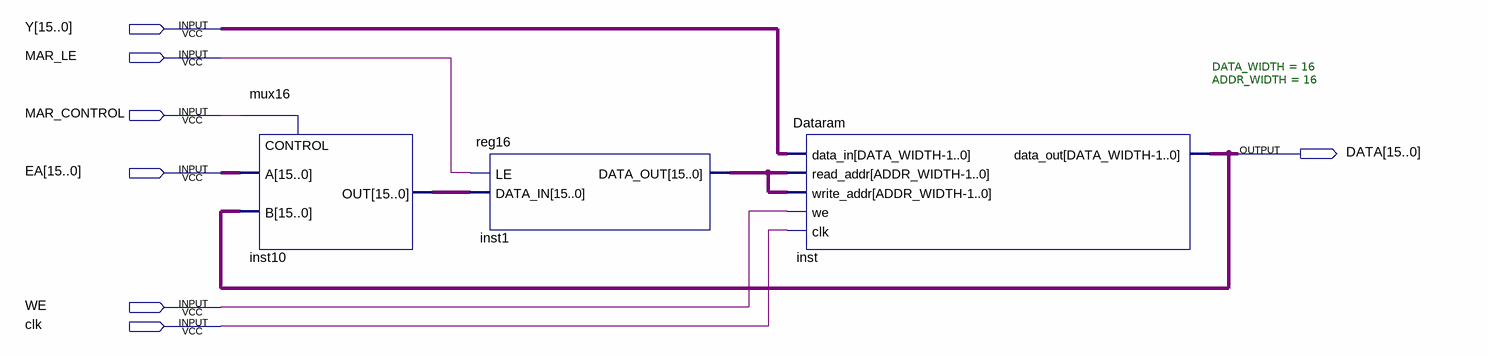
[diagram p0: schematic sheet]
// Quartus schematic Data.bdf as structural Verilog: 3 symbols, 7 pins
module Data (
  input  [15:0] Y,
  input  MAR_LE,
  input  MAR_CONTROL,
  input  [15:0] EA,
  input  WE,
  input  clk,
  output [15:0] DATA
);

  wire [15:0] inst1_data_out, inst10_out;

  mux16 inst10 (.A(EA), .B(DATA), .CONTROL(MAR_CONTROL), .OUT(inst10_out));
  reg16 inst1 (.LE(MAR_LE), .DATA_IN(inst10_out), .DATA_OUT(inst1_data_out));
  Dataram #(.DATA_WIDTH(16), .ADDR_WIDTH(16)) inst (
    .data_in(Y), .read_addr(inst1_data_out), .write_addr(inst1_data_out), .we(WE), .clk(clk), .data_out(DATA));
endmodule
